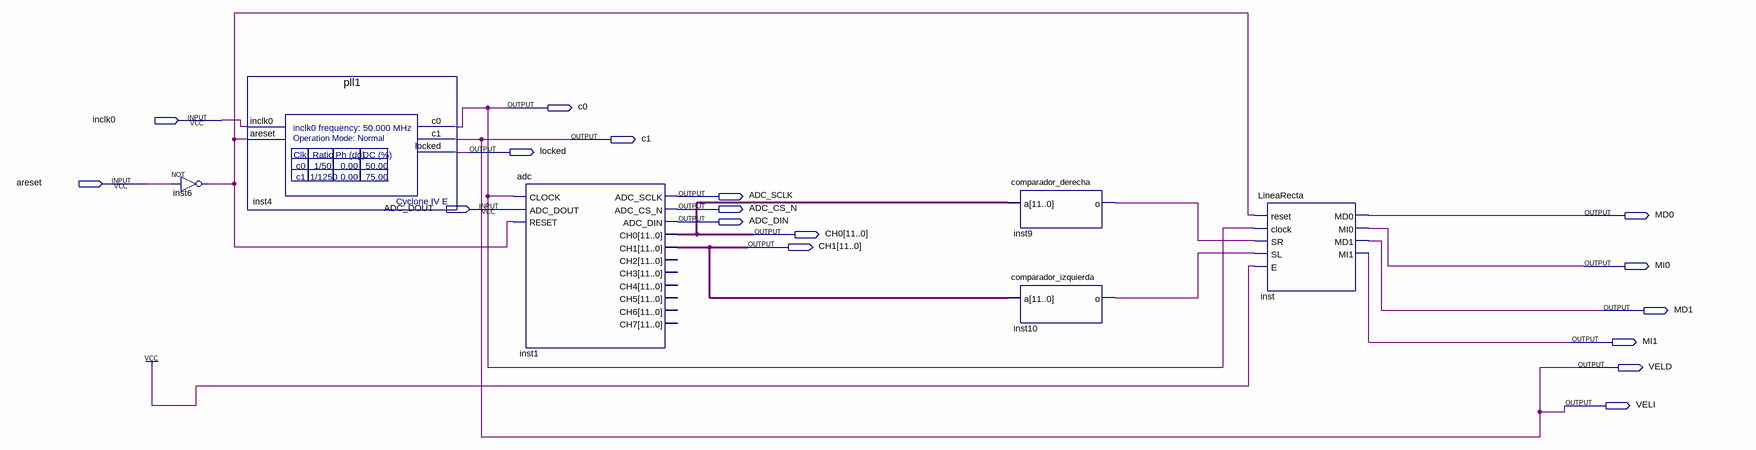
[diagram p0: schematic sheet]
// Quartus schematic Linea_Recta_Completo.bdf as structural Verilog: 6 symbols, 17 pins
module Linea_Recta_Completo (
  input  inclk0,
  input  areset,
  input  ADC_DOUT,
  output c0,
  output c1,
  output locked,
  output ADC_SCLK,
  output ADC_CS_N,
  output MD0,
  output ADC_DIN,
  output [11:0] CH0,
  output [11:0] CH1,
  output MI0,
  output MD1,
  output MI1,
  output VELD,
  output VELI
);

  wire inst6_out, inst9_o, inst10_o;

  not inst6 (inst6_out, areset);
  pll1 inst4 (.inclk0(inclk0), .areset(inst6_out), .c0(c0), .c1(c1), .locked(locked));
  adc inst1 (
    .CLOCK(c0), .ADC_DOUT(ADC_DOUT), .RESET(inst6_out), .ADC_SCLK(ADC_SCLK), .ADC_CS_N(ADC_CS_N),
    .ADC_DIN(ADC_DIN), .CH0(CH0), .CH1(CH1));  // open: CH2, CH3, CH4, CH5, CH6, CH7
  comparador_derecha inst9 (.a(CH0), .o(inst9_o));
  comparador_izquierda inst10 (.a(CH1), .o(inst10_o));
  LineaRecta inst (
    .reset(inst6_out), .clock(c0), .SR(inst9_o), .SL(inst10_o), .E(1'b1), .MD0(MD0), .MI0(MI0), .MD1(MD1),
    .MI1(MI1));

  assign VELD = c1;
  assign VELI = c1;
endmodule
